# EAGLE design CiroSonda V2 (EAGLE 9.5.1)
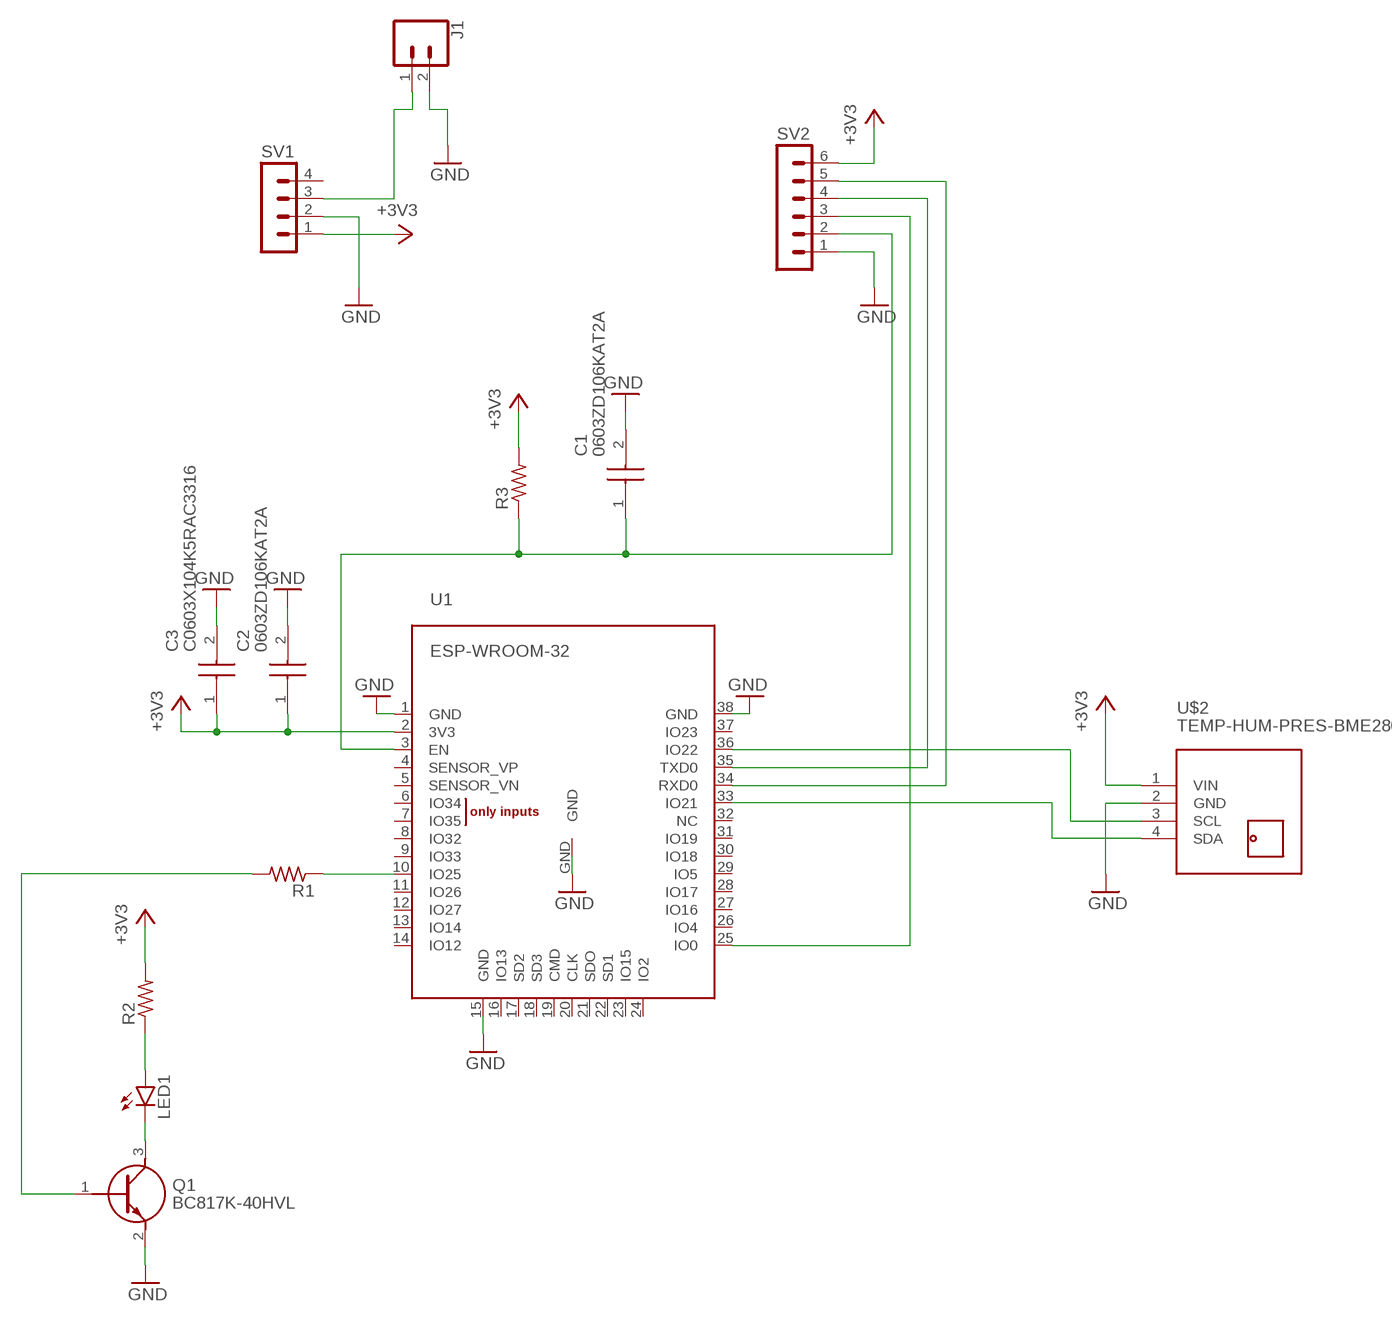
[diagram p0: schematic, sheet 1]

## Parts
C1  0603ZD106KAT2A  [CAPC1608X90N]
C2  0603ZD106KAT2A  [CAPC1608X90N]
C3  C0603X104K5RAC3316  [CAPC1608X95N]
J1  CONN_025MM  [SCREWTERMINAL-5MM-2]
LED1  LED5MM  [LED5MM]
Q1  BC817K-40HVL  [SOT95P230X110-3N]
R1  R-US_R0603  [R0603]
R2  R-US_R0805  [R0805]
R3  R-US_R0603  [R0603]
SV1  MA04-1  [MA04-1]
SV2  MA06-1  [MA06-1]
U1  ESP-WROOM-32  [ESP-WROOM-32]
U$2  TEMP-HUM-PRES-BME280  [TEMP-HUM-PRES-BME280]

## Nets
+3V3: C2.1 C3.1 R2.2 R3.2 SV1.1 SV2.6 U1.2(3V3) U$2.1(VIN)
GND: C1.2 C2.2 C3.2 J1.2 Q1.2(E) SV1.2 SV2.1 U1.1(GND) U1.15(GND) U1.38(GND) U1.GND U$2.2(GND)
N$1: U1.36(IO22) U$2.3(SCL)
N$2: U1.33(IO21) U$2.4(SDA)
N$3: LED1.A R2.1
N$4: J1.1 SV1.3
N$5: SV2.4 U1.35(TXD0)
N$6: SV2.5 U1.34(RXD0)
N$7: SV2.3 U1.25(IO0)
N$8: C1.1 R3.1 SV2.2 U1.3(EN)
N$9: R1.1 U1.10(IO25)
N$10: LED1.K(C) Q1.3(C)
N$11: Q1.1(B) R1.2
Unconnected: SV1.4 U1.4(SENSOR_VP) U1.5(SENSOR_VN) U1.6(IO34) U1.7(IO35) U1.8(IO32) U1.9(IO33) U1.11(IO26) U1.12(IO27) U1.13(IO14) U1.14(IO12) U1.16(IO13) U1.17(SD2) U1.18(SD3) U1.19(CMD) U1.20(CLK) U1.21(SDO) U1.22(SD1) U1.23(IO15) U1.24(IO2) U1.26(IO4) U1.27(IO16) U1.28(IO17) U1.29(IO5) U1.30(IO18) U1.31(IO19) U1.32(NC) U1.37(IO23)

## Library data of the parts
C1 C2 = SamacSys_Parts:0603ZD106KAT2A: Multilayer Ceramic Capacitors MLCC - SMD/SMT 10V 10uF X5R 0603 10%TOL Source: Datasheet <https://componentsearchengine.com/Datasheets/1/0603ZD106KAT2A.pdf>; DESCRIPTION: Multilayer Ceramic Capacitors MLCC - SMD/SMT 10V 10uF X5R 0603 10%TOL; HEIGHT: 0.9mm; MANUFACTURER_NAME: AVX; MANUFACTURER_PART_NUMBER: 0603ZD106KAT2A; MOUSER_PART_NUMBER: 581-0603ZD106KAT2A; MOUSER_PRICE-STOCK: https://www.mouser.com/Search/Refine.aspx?Keyword=581-0603ZD106KAT2A
C3 = SamacSys_Parts:C0603X104K5RAC3316: Multilayer Ceramic Capacitors MLCC - SMD/SMT 50V .1uF X7R AUTO 5mm Flex VW80808 Source: Datasheet <https://componentsearchengine.com/Datasheets/1/C0603X104K5RAC3316.pdf>; DESCRIPTION: Multilayer Ceramic Capacitors MLCC - SMD/SMT 50V .1uF X7R AUTO 5mm Flex VW80808; HEIGHT: 0.95mm; MANUFACTURER_NAME: Kemet; MANUFACTURER_PART_NUMBER: C0603X104K5RAC3316; MOUSER_PART_NUMBER: 80-C0603X104K5R3316; MOUSER_PRICE-STOCK: https://www.mouser.com/Search/Refine.aspx?Keyword=80-C0603X104K5R3316
J1 = SparkFun-Connectors:CONN_02: Multi connection point. Often used as Generic Header-pin footprint for 0.1 inch spaced/style header connections On any of the 0.1 inch spaced packages, you can populate with these: Break Away Headers - Straight <https://www.sparkfun.com/products/116> (PRT-00116) Break Away Male Headers - Right Angle <https://www.sparkfun.com/products/553> (PRT-00553) Female Headers <https://www.sparkfun.com/products/115> (PRT-00115) Break Away Headers - Machine Pin <https://www.sparkfun.com/products/117> (PRT-00117) Break Away Female Headers - Swiss Machine Pin <https://www.sparkfun.com/products/743> (PRT-00743) For SCREWTERMINALS and SPRING TERMINALS visit here: Screw Terimnals on SparkFun.com <https://www.sparkfun.com/search/results?term=Screw+Terminals> (5mm/3.5mm/2.54mm spacing) This device is also useful as a general connection point to wire up your design to another part of your project. Our various solder wires solder well into these plated through hole pads. Hook-Up Wire - Assortment (Stranded, 22 AWG) <https://www.sparkfun.com/products/11375> (PRT-11375) Hook-Up Wire - Assortment (Solid Core, 22 AWG) <https://www.sparkfun.com/products/11367> (PRT-11367) View the entire wire category on our website here <https://www.sparkfun.com/categories/141> Special notes: Molex polarized connector foot print use with: PRT-08233 with associated crimp pins and housings. 2.54_SCREWTERM for use with PRT-10571. 3.5mm Screw Terminal footprints for PRT-08084 5mm Screw Terminal footprints for use with PRT-08432; SF_SKU: PRT-08432
LED1 = led:LED: LED OSRAM: - CHIPLED LG R971, LG N971, LY N971, LG Q971, LY Q971, LO R971, LY R971 LH N974, LH R974 LS Q976, LO Q976, LY Q976 LO Q996 - Hyper CHIPLED LW Q18S LB Q993, LB Q99A, LB R99A - SideLED LS A670, LO A670, LY A670, LG A670, LP A670 LB A673, LV A673, LT A673, LW A673 LH A674 LY A675 LS A676, LA A676, LO A676, LY A676, LW A676 LS A679, LY A679, LG A679 - Hyper Micro SIDELED® LS Y876, LA Y876, LO Y876, LY Y876 LT Y87S - SmartLED LW L88C, LW L88S LB L89C, LB L89S, LG L890 LS L89K, LO L89K, LY L89K LS L896, LA L896, LO L896, LY L896 - TOPLED LS T670, LO T670, LY T670, LG T670, LP T670 LSG T670, LSP T670, LSY T670, LOP T670, LYG T670 LG T671, LOG T671, LSG T671 LB T673, LV T673, LT T673, LW T673 LH T674 LS T676, LA T676, LO T676, LY T676, LB T676, LH T676, LSB T676, LW T676 LB T67C, LV T67C, LT T67C, LS T67K, LO T67K, LY T67K, LW E67C LS E67B, LA E67B, LO E67B, LY E67B, LB E67C, LV E67C, LT E67C LW T67C LS T679, LY T679, LG T679 LS T770, LO T770, LY T770, LG T770, LP T770 LB T773, LV T773, LT T773, LW T773 LH T774 LS E675, LA E675, LY E675, LS T675 LS T776, LA T776, LO T776, LY T776, LB T776 LHGB T686 LT T68C, LB T68C - Hyper Mini TOPLED® LB M676 - Mini TOPLED Santana® LG M470 LS M47K, LO M47K, LY M47K Source: http://www.osram.convergy.de LUXEON: - LUMILED® LXK2-PW12-R00, LXK2-PW12-S00, LXK2-PW14-U00, LXK2-PW14-V00 LXK2-PM12-R00, LXK2-PM12-S00, LXK2-PM14-U00 LXK2-PE12-Q00, LXK2-PE12-R00, LXK2-PE12-S00, LXK2-PE14-T00, LXK2-PE14-U00 LXK2-PB12-K00, LXK2-PB12-L00, LXK2-PB12-M00, LXK2-PB14-N00, LXK2-PB14-P00, LXK2-PB14-Q00 LXK2-PR12-L00, LXK2-PR12-M00, LXK2-PR14-Q00, LXK2-PR14-R00 LXK2-PD12-Q00, LXK2-PD12-R00, LXK2-PD12-S00 LXK2-PH12-R00, LXK2-PH12-S00 LXK2-PL12-P00, LXK2-PL12-Q00, LXK2-PL12-R00 Source: www.luxeon.com KINGBRIGHT: KA-3528ASYC Source: www.kingbright.com
Q1 = SamacSys_Parts:BC817K-40HVL: NEXPERIA - BC817K-40HVL - TRANS, NPN, 45V, 0.5A, 175DEG C, 0.425W Source: Datasheet <https://componentsearchengine.com/Datasheets/1/BC817K-40HVL.pdf>; DESCRIPTION: NEXPERIA - BC817K-40HVL - TRANS, NPN, 45V, 0.5A, 175DEG C, 0.425W; HEIGHT: 1.1mm; MANUFACTURER_NAME: Nexperia; MANUFACTURER_PART_NUMBER: BC817K-40HVL; MOUSER_PART_NUMBER: 771-BC817K-40HVL; MOUSER_PRICE-STOCK: https://www.mouser.com/Search/Refine.aspx?Keyword=771-BC817K-40HVL
R1-R3 = resistor:R-US_: RESISTOR, American symbol
SV1 = con-lstb:MA04-1: PIN HEADER; OC_FARNELL: unknown; OC_NEWARK: unknown
SV2 = con-lstb:MA06-1: PIN HEADER; OC_FARNELL: unknown; OC_NEWARK: unknown
U1 = esp32:ESP-WROOM-32
U$2 = diy-modules:TEMP-HUM-PRES-BME280: Digital Humidity-Temperature-Pressure Sensor based on BME280 device More information about BME280 device is available here: https://www.bosch-sensortec.com/bst/products/all_products/bme280 Click here to find device on ebay.com <http://www.ebay.com/sch/bme280+breakout>

## Board
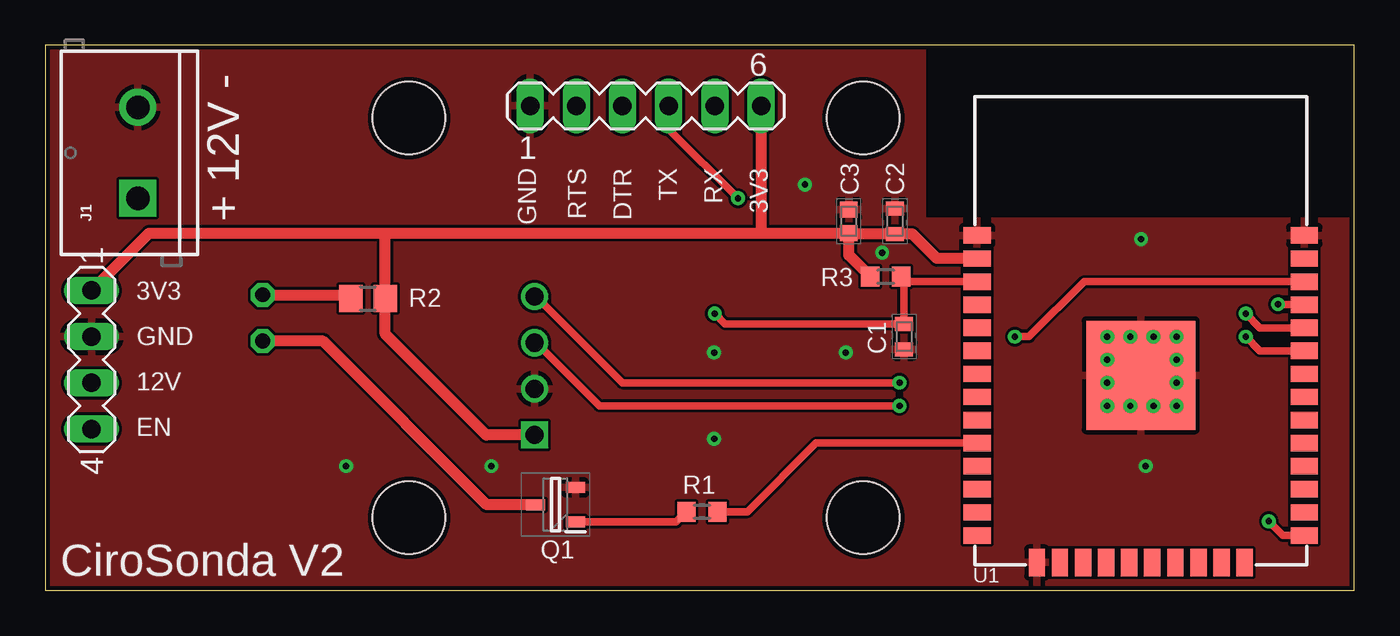
[diagram p1: board, top side]
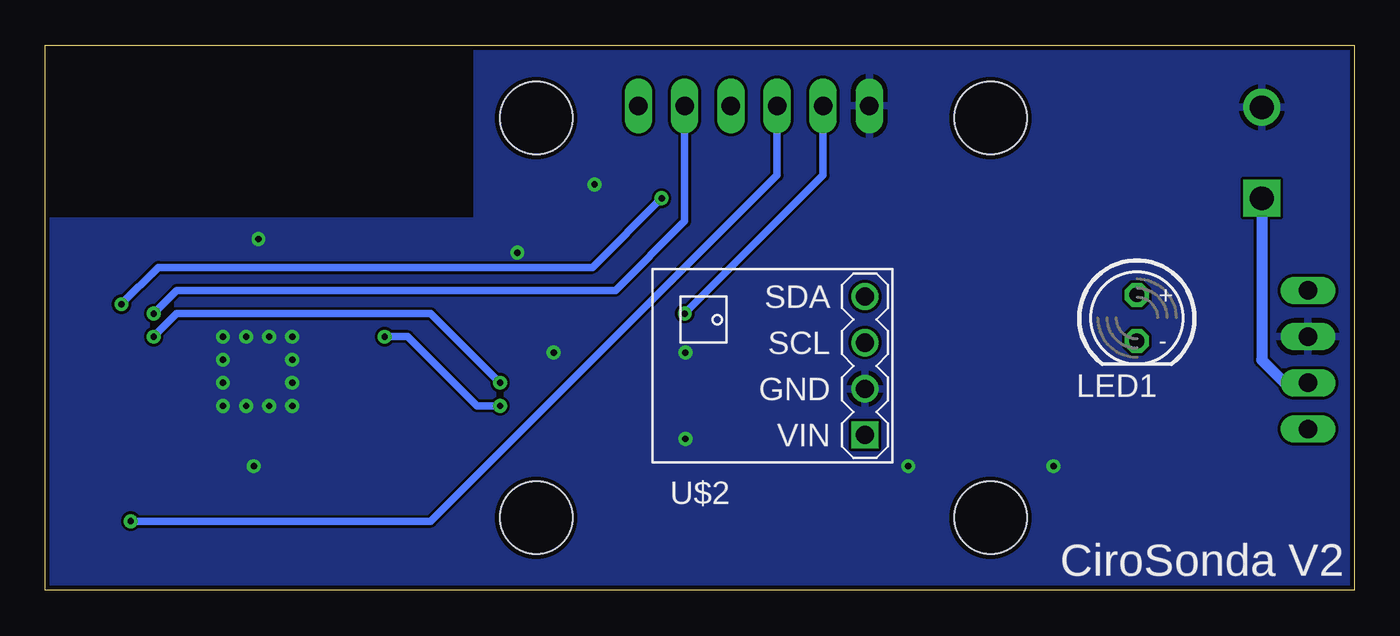
[diagram p2: board, bottom side, seen from below]

Size 72 x 30 mm. Coordinates in mm from the lower left corner, seen from the top.
Outline: 0,0 72,0 72,30 0,30 0,0
Copper layers (1*16): Top 0.035mm / dielectric 1.5mm / Bottom 0.035mm
Design rules "default *": minimum track width 6mil, minimum drill 0.35mm, track to track 6mil, track to pad 6mil, pad to pad 6mil, via to via 6mil, smd to smd 6mil, copper to edge 10mil, drill to drill 6mil, minimum pad ring 10mil, minimum via ring 8mil, stop-mask expansion 4mil, vias tented up to drill 0mil, thermal gap 10mil
Holes 4 mm at 45,26 45,4 20,26 20,4

### Footprints (pad centres in the part's own frame; a part is rotated, then mirrored left to right if it is on the bottom)
CAPC1608X90N = smd 0.78 x 0.99: 1 -0.7,0; 2 0.7,0
CAPC1608X95N = smd 0.89 x 0.98: 1 -0.65,0; 2 0.65,0
SCREWTERMINAL-5MM-2 = drill 1.3 pad 2.032 square: 1 0,0 | drill 1.3 pad 2.032: 2 5,0
LED5MM = drill 0.813 octagon: A -1.27,0; K 1.27,0
SOT95P230X110-3N = smd 1.05 x 0.6: 1 -1.1,0.95; 2 -1.1,-0.95; 3 1.1,0
R0603 = smd 1 x 1.1: 1 -0.85,0; 2 0.85,0
R0805 = smd 1.3 x 1.5: 1 -0.95,0; 2 0.95,0
MA04-1 = drill 1.016 long: 1 -3.81,0; 2 -1.27,0; 3 1.27,0; 4 3.81,0
MA06-1 = drill 1.016 long: 1 -6.35,0; 2 -3.81,0; 3 -1.27,0; 4 1.27,0; 5 3.81,0; 6 6.35,0
ESP-WROOM-32 = smd 0.9 x 1.5: 1 7.7,9; 2 6.43,9; 3 5.16,9; 4 3.89,9; 5 2.62,9; 6 1.35,9; 7 0.08,9; 8 -1.19,9; 9 -2.46,9; 10 -3.73,9; 11 -5,9; 12 -6.27,9; 13 -7.54,9; 14 -8.81,9; 25 -8.81,-9; 26 -7.54,-9; 27 -6.27,-9; 28 -5,-9; 29 -3.73,-9; 30 -2.46,-9; 31 -1.19,-9; 32 0.08,-9; 33 1.35,-9; 34 2.62,-9; 35 3.89,-9; 36 5.16,-9; 37 6.43,-9; 38 7.7,-9 | smd 1.5 x 0.9: 15 -10.3,5.715; 16 -10.3,4.445; 17 -10.3,3.175; 18 -10.3,1.905; 19 -10.3,0.635; 20 -10.3,-0.635; 21 -10.3,-1.905; 22 -10.3,-3.175; 23 -10.3,-4.445; 24 -10.3,-5.715 | smd 6 x 6: GND 0,0
TEMP-HUM-PRES-BME280 = drill 1 square: 1 -5.08,3.81 | drill 1: 2 -5.08,1.27; 3 -5.08,-1.27; 4 -5.08,-3.81

### Placement (x,y rotation side)
C1  47.24,13.97 270 top
C2  46.74,20.32 90 top
C3  44.2,20.32 90 top
J1  5.08,21.59 90 top
LED1  11.95,15 270 bottom
Q1  28.06,4.72 180 top
R1  36.12,4.34 180 top
R2  17.75,16.07 0 top
R3  46.23,17.27 180 top
SV1  2.54,12.7 270 top
SV2  33.02,26.67 0 top
U1  60.26,11.84 90 top
U$2  31.99,12.37 180 bottom

### Tracks (layer width: path | path; a pad name or v marks a point on that pad's centre or on a via)
+3V3
  Top 0.61: SV1.1 5.7,19.67 18.7,19.67 | 18.7,19.67 39.37,19.67 | 39.37,19.67 C3.1 | 18.7,19.67 R2.2 18.7,14.11 24.25,8.56 U$2.1 | R3.2 44.2,18.45 C3.1 | U1.2 49.04,18.27 47.69,19.62 C2.1 44.25,19.62 C3.1 | SV2.6 39.37,19.67
GND  (via drill 0.35)
  other vias: 46.04,18.59 58.42,12.7 58.42,13.97 59.69,13.97 60.96,13.97 62.23,13.97 62.23,12.7 62.23,11.43 62.23,10.16 60.96,10.16 59.69,10.16 58.42,11.43 58.42,10.16 41.79,22.34 44.04,13.09 36.79,13.09 36.79,8.34 24.54,6.84 16.54,6.84 60.29,19.34 60.54,6.84
  pour Top: 0,30.48 48.26,30.48 48.26,20.32 72.39,20.32 72.39,0 0,0
  pour Bottom: 0,0 0,30.48 48.26,30.48 48.26,20.32 72.39,20.32 72.39,0
N$1  (via drill 0.35)
  Top 0.406: v46.99,10.16 30.48,10.16 27,13.64 U$2.3 | U1.36 57.15,17 54.12,13.97 v53.34,13.97
  Bottom 0.406: v46.99,10.16 48.26,10.16 52.07,13.97 v53.34,13.97
N$2  (via drill 0.35)
  Top 0.406: U$2.4 27,16.18 31.75,11.43 v46.99,11.43 | v66.04,13.97 66.82,13.19 U1.33
  Bottom 0.406: v66.04,13.97 64.77,15.24 50.8,15.24 v46.99,11.43
N$3
  Top 0.61: LED1.A 16.6,16.27 R2.1
N$4
  Bottom 0.61: SV1.3 3.81,11.43 5.08,12.7 J1.1
N$5  (via drill 0.35)
  Top 0.406: U1.35 67.85,15.73 v67.82,15.75 | SV2.4 34.29,25.4 v38.1,21.59
  Bottom 0.406: v67.82,15.75 65.8,17.78 41.91,17.78 v38.1,21.59
N$6  (via drill 0.35)
  Top 0.406: U1.34 66.82,14.46 v66.04,15.24
  Bottom 0.406: v66.04,15.24 64.77,16.51 40.64,16.51 36.83,20.32 SV2.5
N$7  (via drill 0.35)
  Top 0.406: U1.25 68.09,3.03 v67.31,3.81
  Bottom 0.406: v67.31,3.81 50.8,3.81 31.75,22.86 SV2.3
N$8  (via drill 0.35)
  Top 0.406: U1.3 47.35,17 R3.1 47.24,17.11 C1.1 37.4,14.67 v36.83,15.24
  Bottom 0.406: v36.83,15.24 29.21,22.86 SV2.2
N$9
  Top 0.406: R1.1 38.63,4.34 42.4,8.11 U1.10
N$10
  Top 0.61: LED1.K 15.27,13.73 24.28,4.72 Q1.3
N$11
  Top 0.406: Q1.1 34.7,3.77 R1.2

### Text on the board
tNames: GND | RTS | DTR | TX | RX | 3V3 | C3 | C2 | + 12V - | 3V3 | GND | C1 | 12V | EN | Q1 | CiroSonda V2
bNames: + | - | CiroSonda V2